# Altium schematic sheet AD8349.SchDoc
size A1
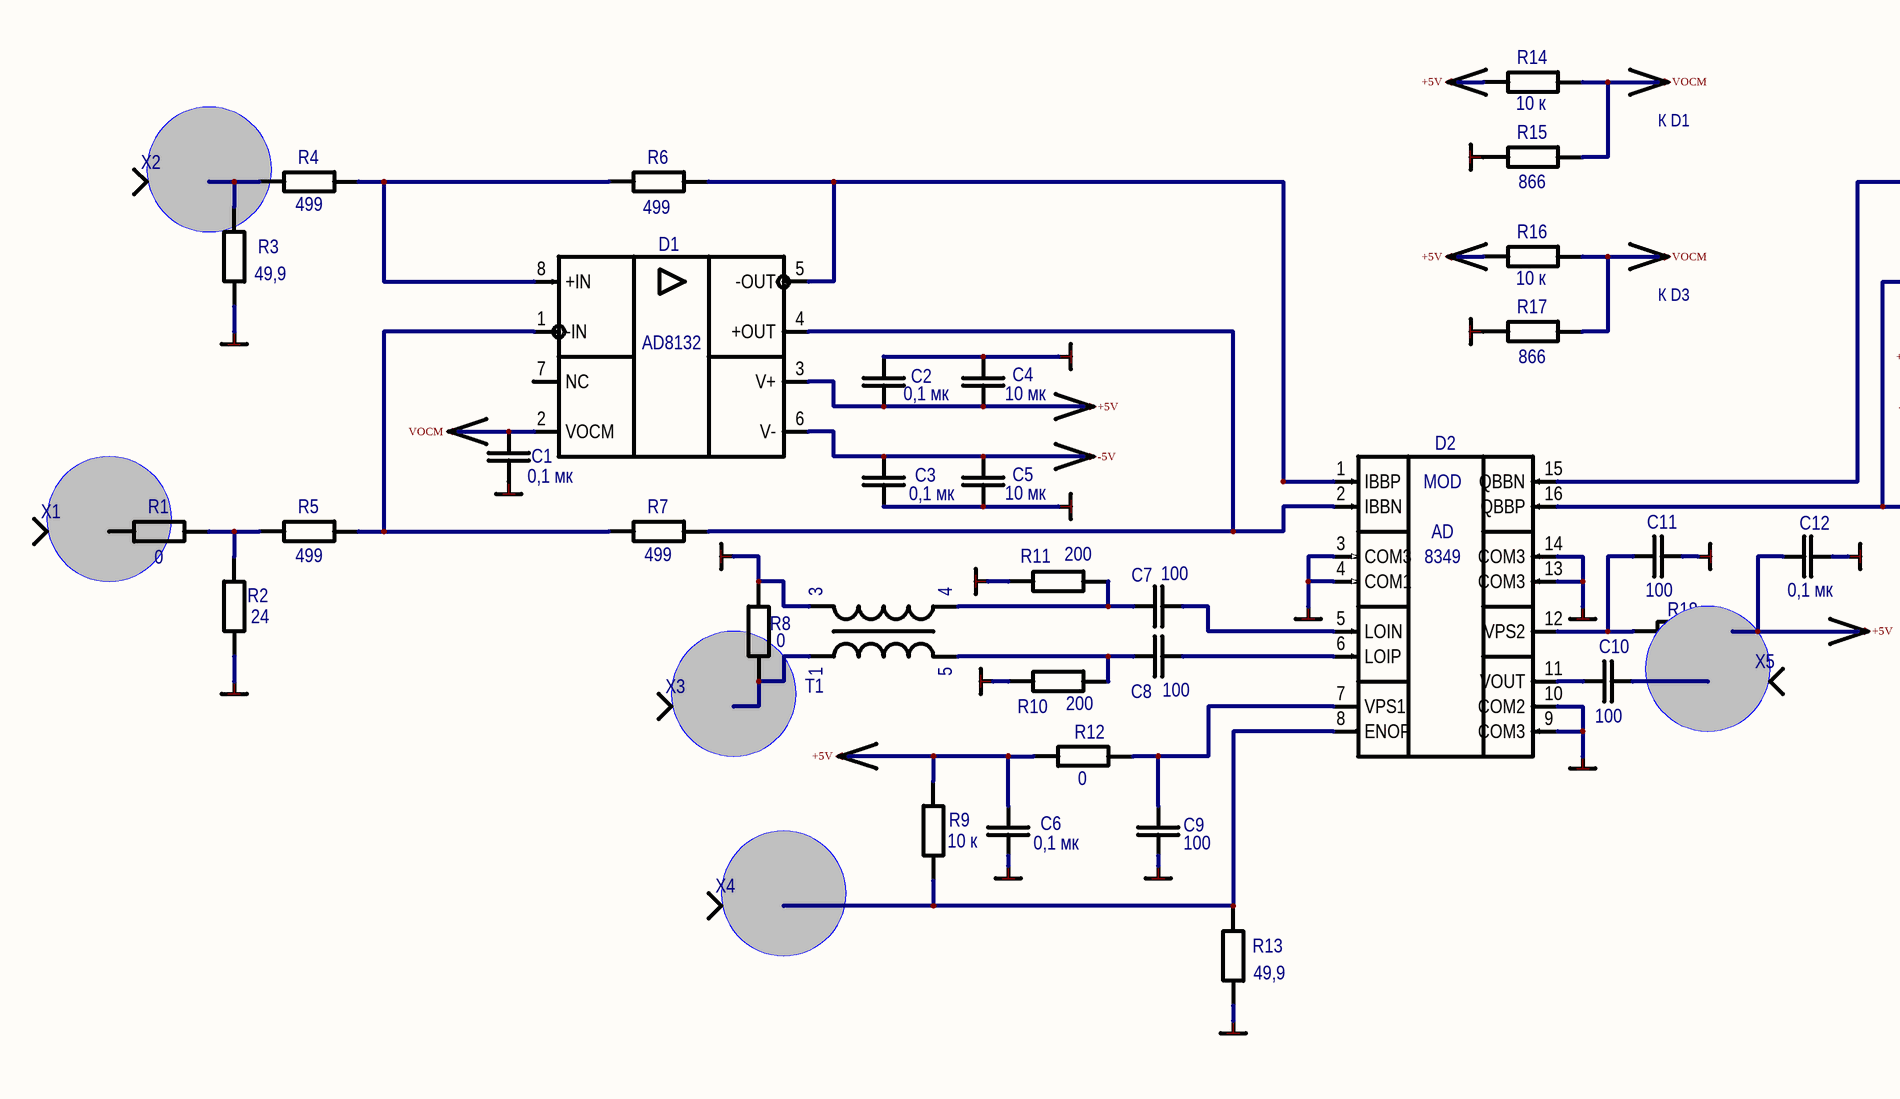
[diagram p0: AD8349.SchDoc, left]
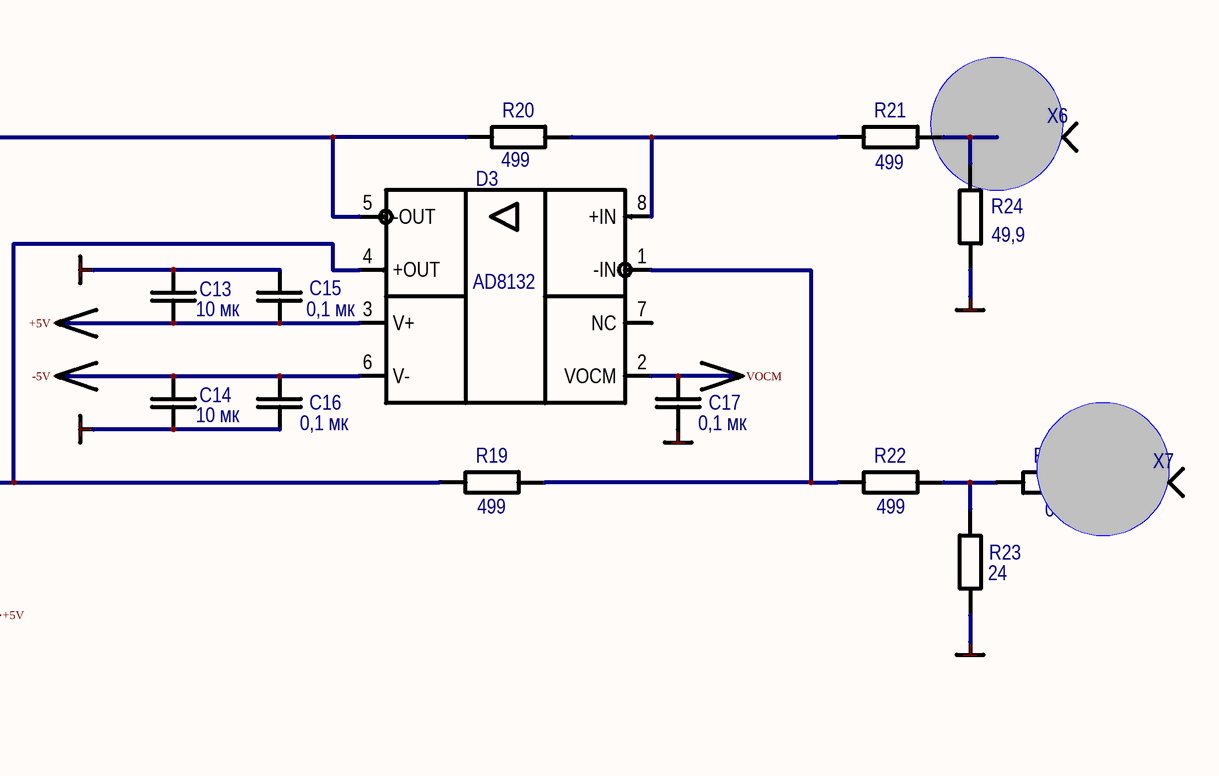
[diagram p1: AD8349.SchDoc, right]

## Parts
(Parts that share a designator on the sheet are numbered #1, #2 ... from top to bottom, then left to right.)
*?#1  VCC  (value not drawn)  (graphical)
*?#2  VCC  (value not drawn)  (graphical)
*?#3  GND  (value not drawn)  (graphical)
*?#4  VCC  (value not drawn)  (graphical)
*?#5  VCC  (value not drawn)  (graphical)
*?#6  GND  (value not drawn)  (graphical)
*?#7  GND  (value not drawn)  (graphical)
*?#8  GND  (value not drawn)  (graphical)
*?#9  GND  (value not drawn)  (graphical)
*?#10  GND  (value not drawn)  (graphical)
*?#11  VCC  (value not drawn)  (graphical)
*?#12  VCC  (value not drawn)  (graphical)
*?#13  VCC  (value not drawn)  (graphical)
*?#14  VCC  (value not drawn)  (graphical)
*?#15  VCC  (value not drawn)  (graphical)
*?#16  VCC  (value not drawn)  (graphical)
*?#17  GND  (value not drawn)  (graphical)
*?#18  GND  (value not drawn)  (graphical)
*?#19  GND  (value not drawn)  (graphical)
*?#20  GND  (value not drawn)  (graphical)
*?#21  GND  (value not drawn)  (graphical)
*?#22  GND  (value not drawn)  (graphical)
*?#23  GND  (value not drawn)  (graphical)
*?#24  GND  (value not drawn)  (graphical)
*?#25  GND  (value not drawn)  (graphical)
*?#26  GND  (value not drawn)  (graphical)
*?#27  VCC  (value not drawn)  (graphical)
*?#28  GND  (value not drawn)  (graphical)
*?#29  GND  (value not drawn)  (graphical)
*?#30  GND  (value not drawn)  (graphical)
*?#31  VCC  (value not drawn)  (graphical)
*?#32  GND  (value not drawn)  (graphical)
*?#33  GND  (value not drawn)  (graphical)
*?#34  GND  (value not drawn)  (graphical)
*?#35  GND  (value not drawn)  (graphical)
C1  0,1 мк  [CAPC1608L]
C2  0,1 мк  [CAPC1608L]
C3  0,1 мк  [CAPC1608L]
C4  10 мк  [CAPC1608L]
C5  10 мк  [CAPC1608L]
C6  0,1 мк  [CAPC1608L]
C7  100  [CAPC1608L]
C8  100  [CAPC1608L]
C9  100  [CAPC1608L]
C10  100  [CAPC1608L]
C11  100  [CAPC1608L]
C12  0,1 мк  [CAPC1608L]
C13  10 мк  [CAPC1608L]
C14  10 мк  [CAPC1608L]
C15  0,1 мк  [CAPC1608L]
C16  0,1 мк  [CAPC1608L]
C17  0,1 мк  [CAPC1608L]
D1  AD8132  [SOIC127P600X196-8N]  (value not drawn)
D2  AD8349  [SOIC127P600X175-16N]  (value not drawn)
D3  AD8132  [SOIC127P600X196-8N]  (value not drawn)
R1  0  [RESC1608L]
R2  24  [RESC1608L]
R3  49,9  [RESC1608L]
R4  499  [RESC1608L]
R5  499  [RESC1608L]
R6  499  [RESC1608L]
R7  499  [RESC1608L]
R8  0  [RESC1608L]
R9  10 к  [RESC1608L]
R10  200  [RESC1608L]
R11  200  [RESC1608L]
R12  0  [RESC1608L]
R13  49,9  [RESC1608L]
R14  10 к  [RESC1608L]
R15  866  [RESC1608L]
R16  10 к  [RESC1608L]
R17  866  [RESC1608L]
R18  0  [RESC1608L]
R19  499  [RESC1608L]
R20  499  [RESC1608L]
R21  499  [RESC1608L]
R22  499  [RESC1608L]
R23  24  [RESC1608L]
R24  49,9  [RESC1608L]
R25  0  [RESC1608L]
T1  ETC1-1-13TR  [TRANS_ETC1-1-13TR]  (value not drawn)
X1  СРГ-50-751ФВ  [TP0.6X1]  (value not drawn)
X2  СРГ-50-751ФВ  [TP0.6X1]  (value not drawn)
X3  СРГ-50-751ФВ  [TP0.6X1]  (value not drawn)
X4  СРГ-50-751ФВ  [TP0.6X1]  (value not drawn)
X5  СРГ-50-751ФВ  [TP0.6X1]  (value not drawn)
X6  СРГ-50-751ФВ  [TP0.6X1]  (value not drawn)
X7  СРГ-50-751ФВ  [TP0.6X1]  (value not drawn)

## Nets
+5V: C2.2 C4.1 C6.2 C12.2 C13.1 C15.2 D1.3(V+) D3.3(V+) R9.2 R12.2 R14.1 R16.1 R18.2
-5V: C3.2 C5.2 C14.2 C16.2 D1.6(V-) D3.6(V-)
GND: C1.1 C2.1 C3.1 C4.2 C5.1 C6.1 C9.1 C11.2 C12.1 C13.2 C14.1 C15.1 C16.1 C17.1 D2.3(COM3) D2.4(COM1) D2.9(COM3) D2.10(COM2) D2.13(COM3) D2.14(COM3) R2.1 R3.2 R8.2 R10.1 R11.1 R13.2 R15.1 R17.1 R23.1 R24.2 T1.3
VOCM: C1.2 C17.2 D1.2(VOCM) D3.2(VOCM) R14.2 R15.2 R16.2 R17.2
NetC7_1: C7.1 R11.2 T1.4
NetC7_2: C7.2 D2.5(LOIN)
NetC8_1: C8.1 R10.2 T1.5
NetC8_2: C8.2 D2.6(LOIP)
NetC9_2: C9.2 D2.7(VPS1) R12.1
NetC10_1: C10.1 D2.11(VOUT)
NetC10_2: C10.2 X5.1
NetC11_1: C11.1 D2.12(VPS2) R18.1
NetD1_1: D1.1(-IN) R5.2 R7.1
NetD1_4: D1.4(+OUT) D2.2(IBBN) R7.2
NetD1_5: D1.5(-OUT) D2.1(IBBP) R6.2
NetD1_8: D1.8(+IN) R4.2 R6.1
NetD2_8: D2.8(ENOP) R9.1 R13.1 X4.1
NetD2_15: D2.15(QBBN) D3.5(-OUT) R20.1
NetD2_16: D2.16(QBBP) D3.4(+OUT) R19.1
NetD3_1: D3.1(-IN) R19.2 R22.1
NetD3_8: D3.8(+IN) R20.2 R21.1
NetR1_1: R1.1 R2.2 R5.1
NetR1_2: R1.2 X1.1
NetR3_1: R3.1 R4.1 X2.1
NetR8_1: R8.1 T1.1 X3.1
NetR21_2: R21.2 R24.1 X6.1
NetR22_2: R22.2 R23.2 R25.2
NetR25_1: R25.1 X7.1

Not connected (* = marked no-connect by the designer): D1 7(NC); D3 7(NC)

## Notes on the sheet
- (near *?#2) К D1
- (near *?#5) К D3
- Title
- Size:
- Date:
- File:
- A1
- Number:
- Time:
- Revision:
- Sheet
- of
- (in symbol AD8349) MOD; AD; 8349

## Library data of the parts
*?#1 *?#2 *?#4 *?#5 *?#11-*?#16 *?#27 *?#31 = VCC: Порт ЕСКД. Для "наложения" на штатный Power Bar
*?#3 *?#6-*?#10 *?#17-*?#26 *?#28-*?#30 *?#32-*?#35 = GND: Корпус ЕСКД. Для "наложения" на штатный Power Bar
C1-C3 C6 C12 C15-C17 = i6124B5A08701E000001: Чип-конденсатор; ManufacturerPartNumber: 0603 X7R 0,1 мкФ ±10 % 50 В; Name: 0603; Power/Voltage: 50 В; TKE/TKC: {TKE/TKC}; Tolerance: ±10 %; PCADSymbol: C; PCADLibrary: PASSIV.LIB; BCPId: *; Manufacturer: *; Type: Конденсатор; Value: 0,1 мк; ImKey: i6124B5A08701E000001; PCADType: C0603; PCADPattern: C0603
C4 C5 C13 C14 = i6124B5A08768E000003: Чип-конденсатор; ManufacturerPartNumber: GRM188R61E106MA73* Murata; Name: 0603; Power/Voltage: 25 В; TKE/TKC: X5R; Tolerance: ±20 %; PCADSymbol: C; PCADLibrary: PASSIV.LIB; BCPId: *; Manufacturer: *; Type: Конденсатор; Value: 10 мк; ImKey: i6124B5A08768E000003; PCADType: C0603; PCADPattern: C0603
C7-C11 = i6124B5A08767E000062: Чип-конденсатор; ManufacturerPartNumber: GCM1885C2A101JA16* Murata; Name: 0603; Power/Voltage: 100 В; TKE/TKC: C0G; Tolerance: ±5 %; PCADSymbol: C; PCADLibrary: PASSIV.LIB; BCPId: *; Manufacturer: *; Type: Конденсатор; Value: 100; ImKey: i6124B5A08767E000062; PCADType: C0603; PCADPattern: C0603
D1 D3 = AD8132: Manufacturer: Analog Devices; Type: Микросхема; BCPId: *; Name: *; Package: SO-8; ManufacturerPartNumber: AD8132
D2 = AD8349: WIDEBAND DIRECT QUADRATURE MODULATOR, 100 - 6000 MHz; Manufacturer: Hittite; Type: Микросхема; SymAuthor: Чернова Ю.Г.; Package: LP4E; ManufacturerPartNumber: AD8349
R1 R8 R12 R25 = i6124B5A0876CD00004D: Чип-резистор; ManufacturerPartNumber: CR0603-J/-000ELF Bourns; Name: 0603; Tolerance: {Tolerance}; PCADSymbol: R; PCADLibrary: PASSIV.LIB; BCPId: *; Manufacturer: *; Type: Резистор; Value: 0; ImKey: i6124B5A0876CD00004D; PCADType: R0603; PCADPattern: R0603
R2 R23 = i6124B5A0876CD000079: Чип-резистор; ManufacturerPartNumber: CR0603-JW-240ELF Bourns; Name: 0603; Tolerance: ±5 %; PCADSymbol: R; PCADLibrary: PASSIV.LIB; BCPId: *; Manufacturer: *; Type: Резистор; Value: 24; ImKey: i6124B5A0876CD000079; PCADType: R0603; PCADPattern: R0603
R3 R13 R24 = i6124B5A08741A00000E: Чип-резистор; ManufacturerPartNumber: Р1-12-0,1-49,9 Ом ±1 % - Т; Name: 0603; Tolerance: ±1 %; Power/Voltage: 0,1 Вт; TU/GOST: АЛЯР.434110.005 ТУ; BCPId: *; Manufacturer: *; Type: Резистор; Value: 49,9; ImKey: i6124B5A08741A00000E
R4-R7 R19-R22 = i6124B5A08741A00002A: Чип-резистор; ManufacturerPartNumber: Р1-12-0,1-499 Ом ±1 % - Т; Name: 0603; Tolerance: ±1 %; Power/Voltage: 0,1 Вт; TU/GOST: АЛЯР.434110.005 ТУ; BCPId: *; Manufacturer: *; Type: Резистор; Value: 499; ImKey: i6124B5A08741A00002A
R9 R14 R16 = i6124B5A0876CD000030: Чип-резистор; ManufacturerPartNumber: CR0603-JW-103ELF Bourns; Name: 0603; Tolerance: ±5 %; PCADSymbol: R; PCADLibrary: PASSIV.LIB; BCPId: *; Manufacturer: *; Type: Резистор; Value: 10 к; ImKey: i6124B5A0876CD000030; PCADType: R0603; PCADPattern: R0603
R10 R11 = i6124B5A0876CD000039: Чип-резистор; ManufacturerPartNumber: CR0603-JW-201ELF Bourns; Name: 0603; Tolerance: ±5 %; PCADSymbol: R; PCADLibrary: PASSIV.LIB; BCPId: *; Manufacturer: *; Type: Резистор; Value: 200; ImKey: i6124B5A0876CD000039; PCADType: R0603; PCADPattern: R0603
R15 R17 = R0603: Чип-резистор; ManufacturerPartNumber: CR0603-FX-8660ELF Bourns; Name: 0603; Tolerance: ±1 %; BCPId: *; Manufacturer: *; Type: Резистор; Value: 866
R18 = i6124B5A08711900002C: Чип-резистор; ManufacturerPartNumber: 0603 0 Ом; Name: 0603; Tolerance: {Tolerance}; Power/Voltage: 0,063 Вт; BCPId: *; Manufacturer: *; Type: Резистор; Value: 0; ImKey: i6124B5A08711900002C
T1 = ETC1-1-13TR: Трансформатор; Manufacturer*: Mini-Circuits; Power/Voltage*: 0.25Вт; BCPId: *; Type: Трансформатор; ManufacturerPartNumber: ETC1-1-13TR; Package: SM-22
X1-X7 = СРГ-50-751ФВ: Переход; TU/GOST: ВР0.364.049 ТУ; BCPId: *; Name: *; ManufacturerPartNumber: СРГ-50-751ФВ; Type: Переход